# EasyEDA Pro project IMU_Module.eprj

# Schematic Schematic1
Create Date: 2022-08-20; Page Name: P1; Project Name: IMU_Module; Schematic Name: Schematic1; Update Date: 2022-08-20; Company: EmbeddedAT; Drawed: KeonMan
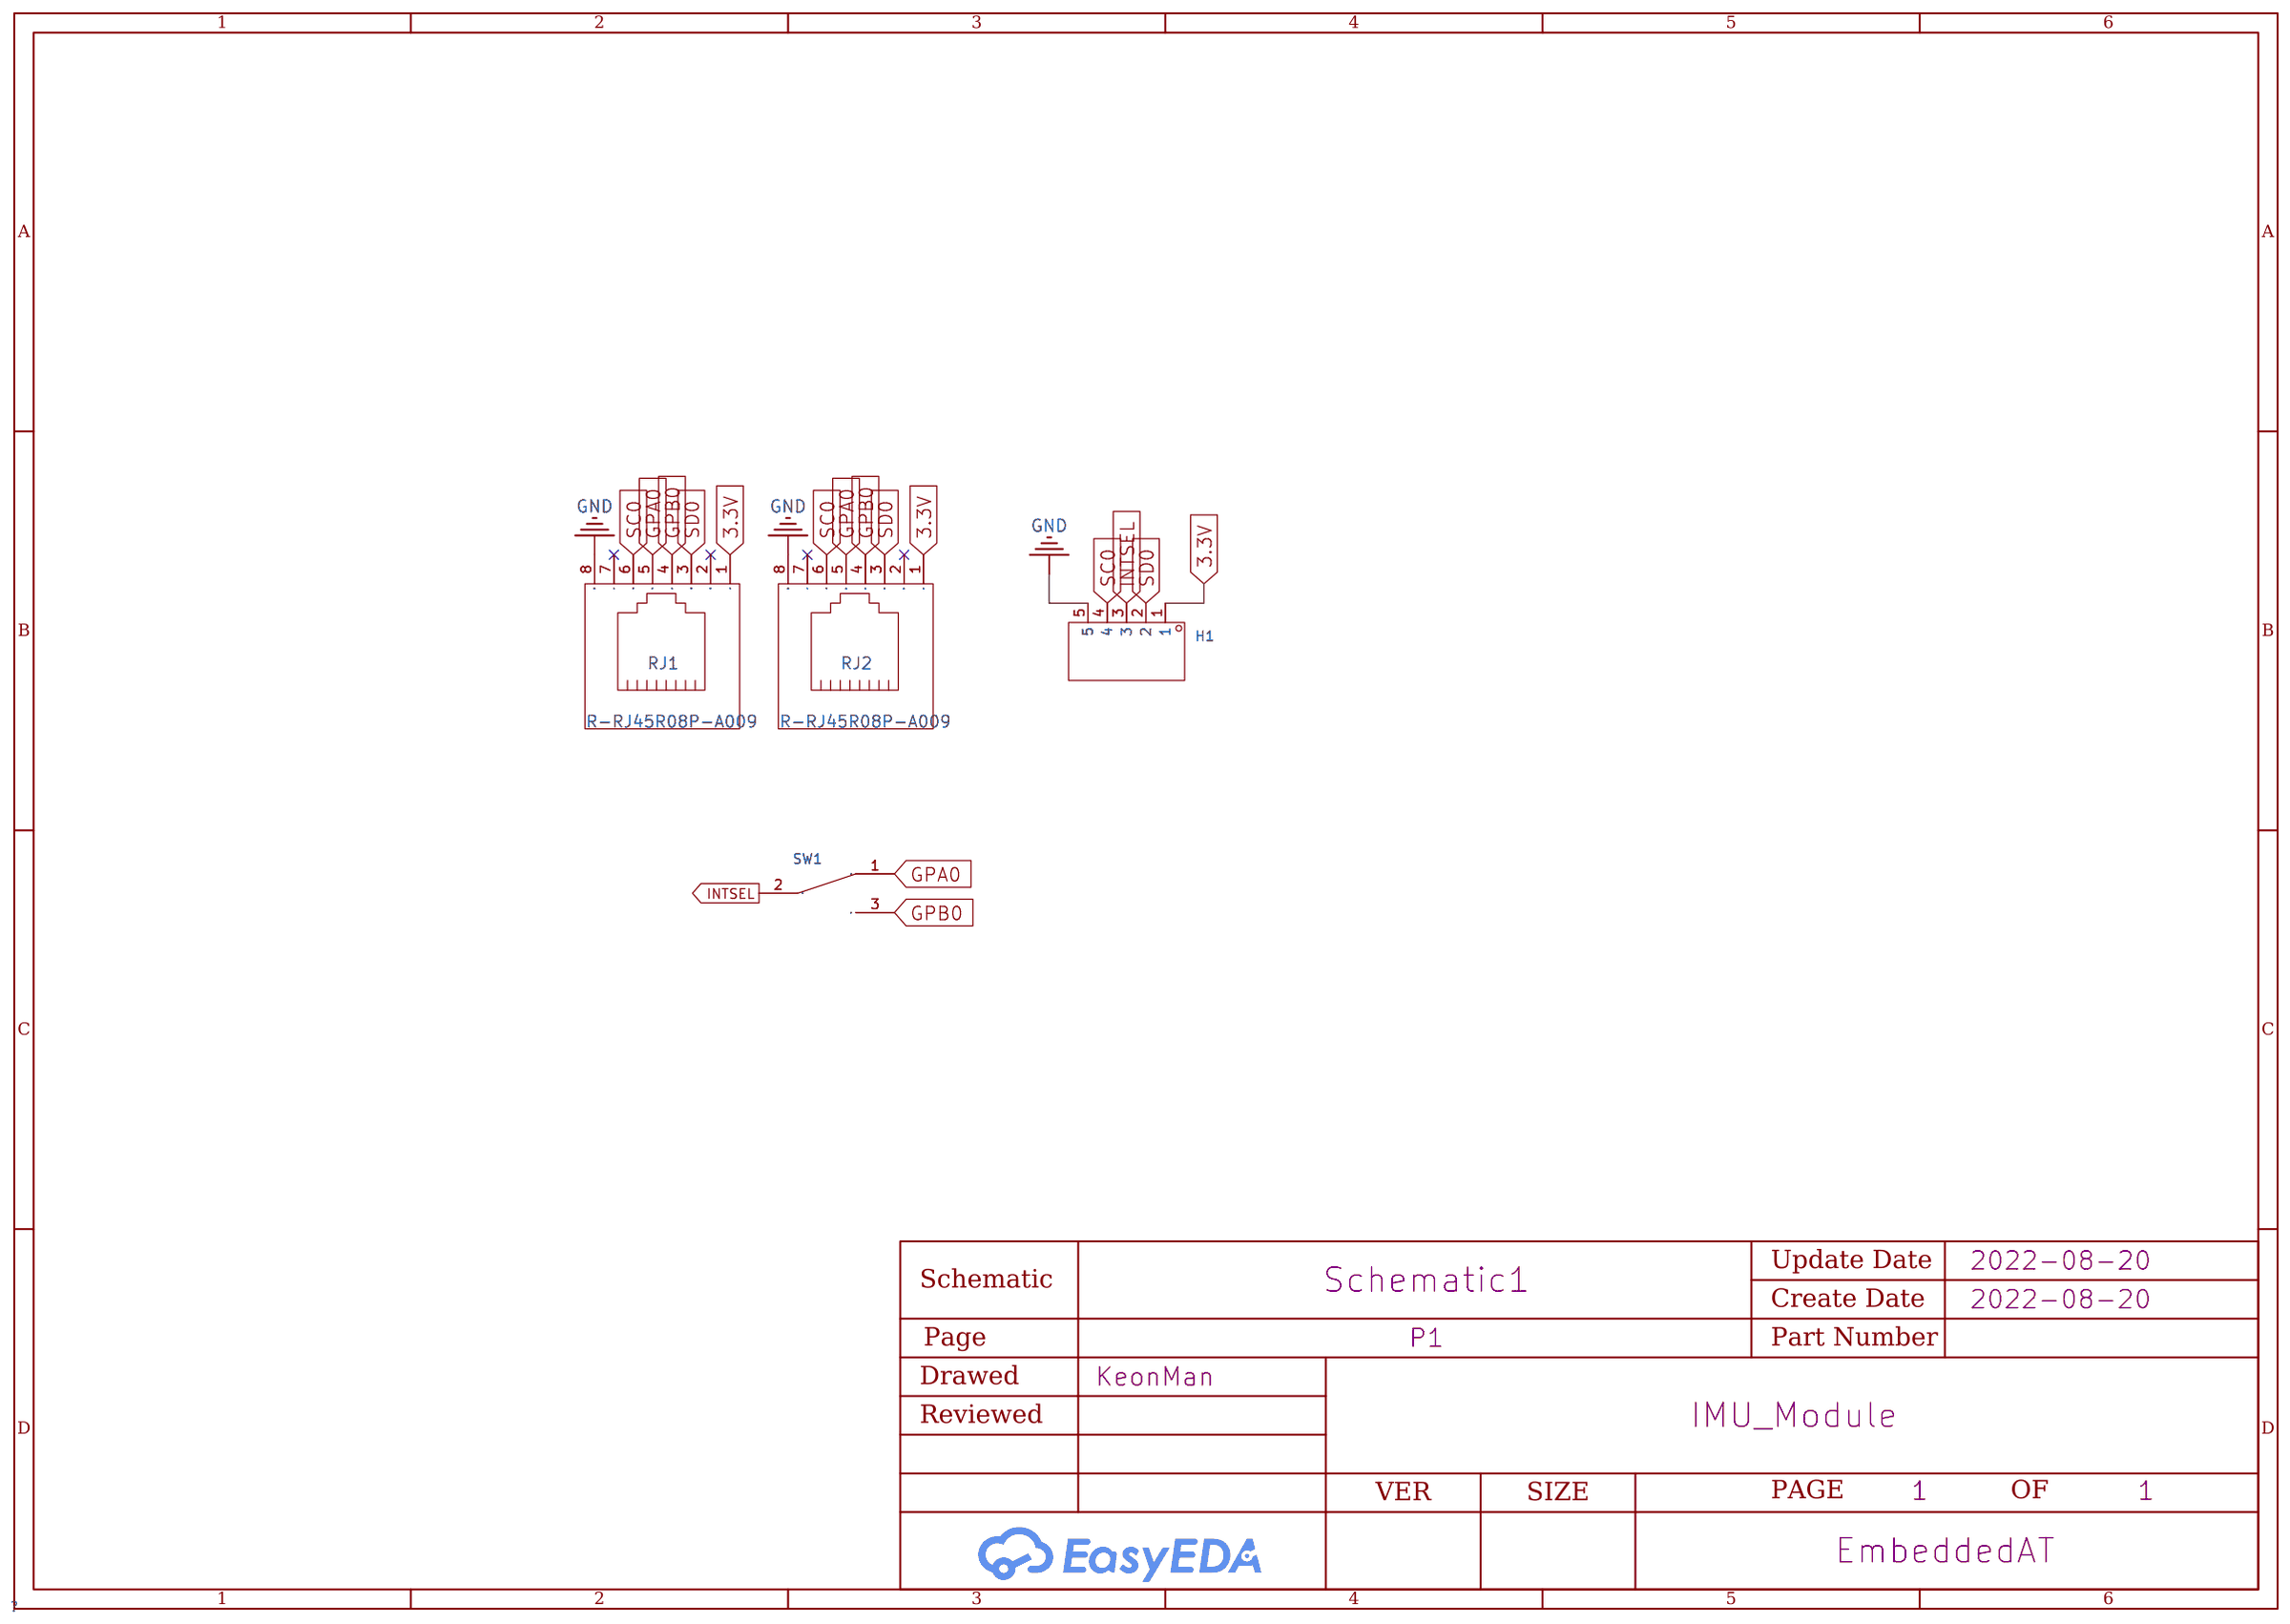
[diagram p0: schematic sheet]

## Parts
H1  -  [HDR-TH_5P-P2.54-V-M]
RJ1  R-RJ45R08P-A009  [RJ45-TH_R-RJ45R08P-A009]
RJ2  R-RJ45R08P-A009  [RJ45-TH_R-RJ45R08P-A009]
SW1  -  [SW-TH_EG1218]

## Library data of the parts
H1 = B-2100S05P-A110: 间距:2.54mm;总PIN位数:5;排数:1;插针结构:1x5P;行距:-;安装类型:直插;圆针/方针:-;额定电流:-;额定电压:-;配合针长度:6mm;塑高:2.54mm;端接针长度:3mm;触头材质:黄铜;触头镀层:-;工作温度范围:-40~+105;颜色:黑色;; LCSC Part Name: 2.54mm 1x5P; Supplier Part: C124379; Manufacturer: Ckmtw(灿科盟); Supplier Footprint: 插件,P=2.54mm; JLCPCB Part Class: Extended Part; Datasheet: https://atta.szlcsc.com/upload/public/pdf/source/20170821/C124379_1503303308004901533.pdf; Supplier: LCSC; Pitch: 2.54mm; Number of Pins: 5; Number of Rows: 1; Pin Structure: 1x5P; Mounting Type: 直插; Length of Mating Pin: 6mm; Insulation Height: 2.54mm; Length of End Connection Pin: 3mm; Contact Material: 黄铜; Operating Temperature Range: -40~+105; Color: 黑色
RJ1 RJ2 = R-RJ45R08P-A009: link: https://atta.szlcsc.com/upload/public/pdf/source/20211021/D54662BD8381AD1D1DF920996089EE18.pdf; Supplier: LCSC; Supplier Part: C2902700; Manufacturer: Ckmtw(灿科盟); JLCPCB Part Class: Extended Part
SW1 = EG1218: 额定电压 DC:30V;触点额定电流:200mA @ 30VDC;开关功能:On-On;电路结构:SPDT;额定电压 AC:-;; Supplier Part: C273394; Manufacturer: E-Switch; Supplier Footprint: Through Hole; JLCPCB Part Class: Extended Part; Datasheet: https://atta.szlcsc.com/upload/public/pdf/source/20180927/C273394_90E3D6196109E23F55625D9195114BDA.pdf; Supplier: LCSC; Rated Voltage(DC): 30V; Actuator Orientation: Vertical; Switch Height: 2mm; Contact Material: Copper alloy; Contact Rating @ Voltage: 200mA @ 30VDC; Switch Function: On-On; Operating Temperature: -20°C ~ 70°C; Operating Force: 250±100gf; Contact Finish: Silver; Mounting Type: Through Hole; Actuator Type: Standard; Termination Style: PC 引脚; Circuit: SPDT; Contact Timing: Non Shorting

## Nets
3.3V: H1.1 RJ1.1 RJ2.1
GND: H1.5 RJ1.8 RJ2.8
GPA0: RJ1.5 RJ2.5 SW1.1
GPB0: RJ1.4 RJ2.4 SW1.3
INTSEL: H1.3 SW1.2
SC0: H1.4 RJ1.6 RJ2.6
SD0: H1.2 RJ1.3 RJ2.3

Not connected (* = marked no-connect by the designer): RJ1 2* 7*; RJ2 2* 7*

# Board PCB1
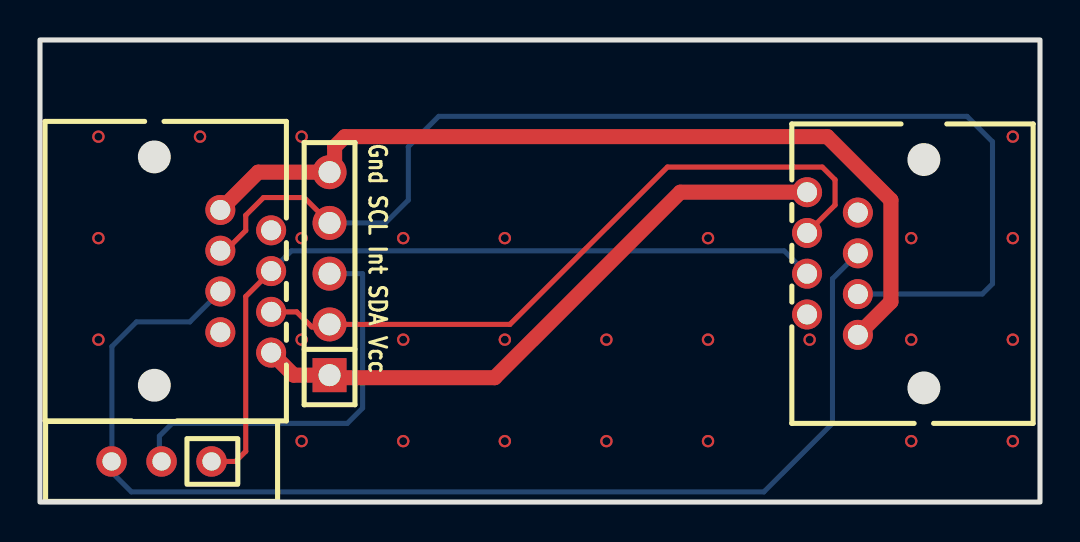
[diagram p1: board, top side]
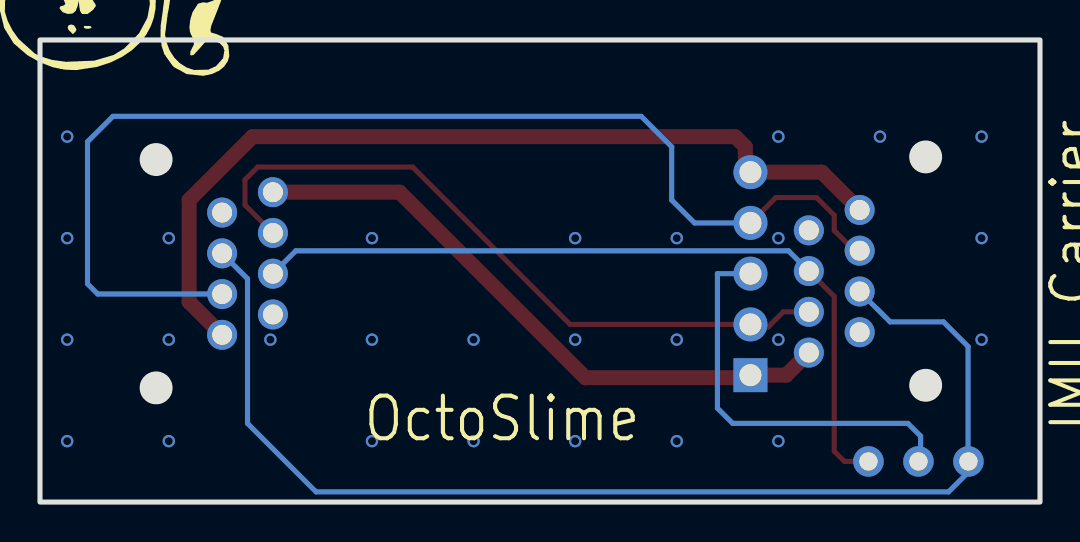
[diagram p2: board, bottom side, seen from below]

Outline 50 x 23.13 mm; copper layers: Top Layer, Bottom Layer. Coordinates in mm from the lower left corner of the outline.
Outline path: rectangle 0,23.13 50,0
Stack: Top Layer 0.035mm / Dielectric1 1.51mm FR4 er 4.5 / Bottom Layer 0.035mm

## Design rules (mm)
spacing safeClearance (default): track to track 0.152, other pairs 0.152 to 0.3
track width trackWidth (default): min 0.127, default 0.254, max 2.54
differential pair differentialPair (default): width min 0.127, default 0.254, max 2.54; gap min 0.152, default 0.152
via viaSize (default): diameter min 0.5, default 0.61, max 10; hole min 0.3, default 0.305, max 6

## Placement (name value [footprint] x y rotation side)
H1  -  [HDR-TH_5P-P2.54-V-M]  14.48 11.43 90 top
RJ1  R-RJ45R08P-A009  [RJ45-TH_R-RJ45R08P-A009]  10.29 11.05 270 top
RJ2  R-RJ45R08P-A009  [RJ45-TH_R-RJ45R08P-A009]  39.62 11.94 90 top
SW1  -  [SW-TH_EG1218]  6.08 2.03 180 top

## Footprints (pads in the part's own frame, mm; a bottom-side part is the same pattern mirrored in y, then rotated)
HDR-TH_5P-P2.54-V-M
  rect 1.7x1.7 hole 1.1: 1(-5.08,0)
  round 1.7 hole 1.1: 2(-2.54,0) 3(0,0) 4(2.54,0) 5(5.08,0)
RJ45-TH_R-RJ45R08P-A009
  round 1.5 hole 1: 1(3.57,1.27) 2(2.55,-1.27) 3(1.53,1.27) 4(0.51,-1.27) 5(-0.51,1.27) 6(-1.53,-1.27) 7(-2.55,1.27) 8(-3.57,-1.27)
SW-TH_EG1218
  round 1.524 hole 0.914: 1(-2.499,0) 2(0,0) 3(2.499,0)

## Nets
As in the schematic.

Pads without a net: RJ1 2 7; RJ2 2 7

## Via types
v1: diameter 0.62, hole 0.4, Top Layer to Bottom Layer, 27 vias

## Routing (per net, layer and track width the routed paths; a pad name or vN(x,y) marks a point on that pad's centre or on a via; arc(x,y) is an arc through that point)
3.3V: length 31.2
  Top Layer w0.75: 38.35,15.51 32.02,15.51 22.73,6.22 14.6,6.22 H1.1 12.69,6.35 11.56,7.48
GND: length 44.4
  Top Layer w0.75: RJ2.8 42.54,10.02 42.54,15.11 39.37,18.29 15.24,18.29 14.73,17.78 14.73,16.76 H1.5 10.91,16.51 RJ1.8
  vias: v1(2.92,18.29) v1(2.92,13.21) v1(2.92,8.13) v1(8,18.29) v1(13.08,18.29) v1(13.08,13.21) v1(13.08,8.13) v1(13.08,3.05) v1(18.16,13.21) v1(18.16,8.13) v1(18.16,3.05) v1(23.24,13.21) v1(23.24,8.13) v1(23.24,3.05) v1(28.32,8.13) v1(28.32,3.05) v1(33.4,13.21) v1(33.4,8.13) v1(33.4,3.05) v1(38.48,8.13) v1(43.56,13.21) v1(43.56,8.13) v1(43.56,3.05) v1(48.64,18.29) v1(48.64,13.21) v1(48.64,8.13) v1(48.64,3.05)
GPA0: length 39.1
  Top Layer w0.254: 11.56,11.56 10.29,10.29 10.29,2.54 9.78,2.03 8.6,2.03
  Bottom Layer w0.254: 11.56,11.56 12.57,12.57 37.21,12.57 38.35,11.43
GPB0: length 59.8
  Bottom Layer w0.254: RJ2.4 39.62,11.18 39.62,3.94 36.19,0.51 4.57,0.51 3.6,1.48 3.6,7.79 4.83,9.02 7.5,9.02 RJ1.4
INTSEL: length 20.4
  Bottom Layer w0.254: H1.3 16.13,11.43 16.13,4.7 15.37,3.94 6.6,3.94 5.97,3.3 5.97,2.16 6.1,2.03
SC0: length 59
  Top Layer w0.254: H1.4 13.21,15.24 11.18,15.24 10.29,14.35 10.29,13.59 9.28,12.58 RJ1.6
  Bottom Layer w0.254: RJ2.6 40.9,10.41 47.12,10.41 47.62,10.92 47.62,18.03 46.35,19.3 19.94,19.3 18.41,17.78 18.41,15.11 17.27,13.97 H1.4
SD0: length 35.3
  Top Layer w0.254: 11.56,9.52 12.83,9.52 13.59,8.76 14.35,8.76 H1.2 23.5,8.89 31.37,16.76 39.12,16.76 39.75,16.13 39.75,14.87 RJ2.3

## Copper pours and planes (outline as drawn; the poured copper is in the pictures)
GND on Top Layer: -2.16,24.64 51.69,24.64 51.69,-2.03 -2.16,-2.03
GND on Bottom Layer: -0.89,23.75 50.8,23.75 50.8,-1.02 -0.89,-1.02

## Text on the board
Bottom Silkscreen Layer: OctoSlime | IMU Carrier
Top Silkscreen Layer: Gnd SCL Int SDA Vcc
